# Altium schematic sheet MCP2515_PINOUT.SchDoc
size A; SheetNumber: 7; SheetTotal: 7
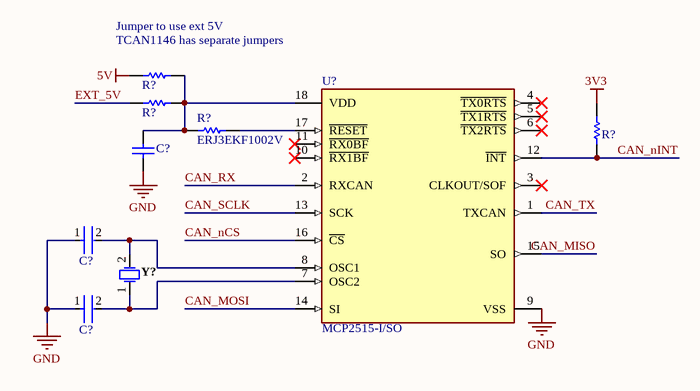
[diagram p0: MCP2515_PINOUT.SchDoc]

## Parts
(Parts that share a designator on the sheet are numbered #1, #2 ... from top to bottom, then left to right.)
C?#1  1206GC102KAT1A  [AVX-1206-2_L]  (value not drawn)
C?#2  GRM188R60J106ME47D  [FP-GRM188-0_1-e0_2_0_55-IPC_A]  (value not drawn)
C?#3  GRM188R60J106ME47D  [FP-GRM188-0_1-e0_2_0_55-IPC_A]  (value not drawn)
R?#1  0402 JUMPER 0 OHM  [RESC1005X40X25NL05T05]  (value not drawn)
R?#2  0402 JUMPER 0 OHM  [RESC1005X40X25NL05T05]  (value not drawn)
R?#3  ERJ3EKF1002V  [RESC1609X55X30LL15T15]  (value not drawn)
R?#4  ERJ3EKF1002V  [RESC1609X55X30LL15T15]
U?  MCP2515-I/SO  [FP-C04-051-MFG]
Y?  FOXSLF/160-20  [FOX-FOXSLF160-20]  (value not drawn)

## Nets
3V3: R?#3.1
5V: R?#1.1
GND: C?#1.1 C?#2.1 C?#3.1 U?.9(VSS)
CAN_MISO: U?.15(SO)
CAN_MOSI: U?.14(SI)
CAN_nCS: U?.16(~{CS})
CAN_nINT: R?#3.2 U?.12(~{INT})
CAN_RX: U?.2(RXCAN)
CAN_SCLK: U?.13(SCK)
CAN_TX: U?.1(TXCAN)
EXT_5V: R?#2.1
NetC?#1_2: C?#1.2 R?#1.2 R?#2.2 R?#4.1 U?.18(VDD)
NetC?#2_2: C?#2.2 U?.8(OSC1) Y?.2
NetC?#3_2: C?#3.2 U?.7(OSC2) Y?.1
NetR?#4_2: R?#4.2 U?.17(~{RESET})

Not connected (* = marked no-connect by the designer): U? 3(CLKOUT/SOF)* 4(~{TX0RTS})* 5(~{TX1RTS})* 6(~{TX2RTS})* 10(~{RX1BF})* 11(~{RX0BF})*

## Notes on the sheet
- (near R?#1) Jumper to use ext 5V
- (near R?#1) TCAN1146 has separate jumpers

## Library data of the parts
C?#1 = CMP-2000-05468-1: Chip Capacitor, 1 nF, +/- 10%, -55 to 125 degC, 1206 (3216 Metric), RoHS, Tape and Reel; Manufacturer: AVX; Capacitance: 0.001uF; Dielectric: X7R; Voltage Rating DC: 2000V; Package Reference: 1206; Datasheet Version: 11/2010; Mounting Technology: SurfaceMount; Manufacturer URL: http://www.avx.com/; Tolerance: 10%; Tolerance (%): ±10%; PartNumber: 1206GC102KAT1A; Datasheet URL: https://datasheet.ciiva.com/11787/0900766b80ed4c37-11787781.pdf; Package Description: 2-Pin SMD, Body 3.4 x 1.8 mm; Case Size/Dimension: 1206; Rated Voltage: 2000V
C?#2 C?#3 = CMP-2006-02792-2: Chip Multilayer Ceramic Capacitors for General Purpose, 0603, 10uF, X5R, 15%, 20%, 6.3V; Packaging: Tape and Reel; Voltage Rating (DC): 6.3V; Width: 0.031inch; Termination: SMD/SMT; Dielectric: X5R; Package Quantity: 4000; Voltage Rating: 6.3V; Capacitance: 10uF; Case/Package: 0603; Min Operating Temperature: -55°C; Voltage: 6.3V; Length: 1.6mm; Thickness: 0.035inch; Lead Free: Lead Free; Depth: 0.8mm; Case Code (Imperial): 0603; Max Operating Temperature: 85°C; Material: Ceramic; Height: 0.8mm; Tolerance: 20%; Mount: Surface Mount; REACH SVHC: No SVHC; Radiation Hardening: No; Case Code (Metric): 1608
R?#1 R?#2 = CMP-009-00206-2: READ THE NAME
R?#3 R?#4 = CMP-1012-00623-3: Chip Resistor, 10 KOhm, +/- 1%, 0.1 W, -55 to 155 degC, 0603 (1608 Metric), RoHS, Tape and Reel; Manufacturer: Panasonic; Voltage Rating: 75V; Case\/Package: 0603; Power Rating: 100mW; Resistance: 10KOhm; Temperature Coefficient: 100ppm\/degreesC; Number of Pins: 2; Package Reference: 603; Depth: 0.8mm; Mount: SurfaceMount; Package Description: 2-Pin Surface Mount Device, Body 1.6 x 0.85 mm; Datasheet Version: 02/2017; Length: 1.6mm; Lead Free: LeadFree; Height: 0.45mm; Number of Terminations: 2; Max Power Dissipation: 100mW; Min Operating Temperature: -55degC; Datasheet URL: https://industrial.panasonic.com/cdbs/www-data/pdf/RDA0000/AOA0000C304.pdf; Termination: SMD/SMT; Case Code (Metric): 1608; Case Code (Imperial): 0603; Tolerance: 1%; Max Operating Temperature: 155degC; RoHSCompliant: true; Voltage Rating (DC): 75V; Radiation Hardening: No; Packaging: TapeandReel; Composition: ThickFilm; Mounting Technology: SurfaceMount; Manufacturer URL: http://www.panasonic.com/; Width: 0.031inch; REACH SVHC: NoSVHC; Contact Plating: Tin; Military Standard: Not; Package Quantity: 1
U? = CMP-0186-00133-3: IC CAN CONTROLLER W/SPI 18SOIC; Manufacturer: Microchip; Min Supply Voltage: 2.7V; Max Supply Voltage: 5.5V; Standoff Height: 0.1mm; Nominal Supply Current: 10mA; Interface: SPI,CAN; Lead Free: Yes; Digikey Description: IC CAN CONTROLLER W/SPI 18SOIC; Category: IC; RoHS: TRUE; Manufacturer Part Number: MCP2515-I/SO; ComponentLink2URL: http://ww1.microchip.com/downloads/en/DeviceDoc/MCP2515-Stand-Alone-CAN-Controller-with-SPI-20001801J.pdf; Mouser Description: CAN Interface IC W/ SPI Interface; Device Class L2: Interface ICs; Package: C04-051; Automotive: No; Function: Controller; Octopart: https://octopart.com/mcp2515-i%2Fso-microchip-430187; Temperature: -40°C to +85°C; Ipc Land Pattern Name: SOIC127P1030X265-18; Ambient Temperature Range Low: -65°C; Height: 2.65mm; Device Class L1: Integrated Circuits (ICs); Ambient Temperature Range High: +125°C; Footprint Url: http://ww1.microchip.com/downloads/en/DeviceDoc/18L_SOIC_Wide_7.50_SO_C04-0051D.pdf; Temperature Range Low: -40°C; Device Class L3: Controllers; Temperature Range High: +85°C; ComponentLink2Description: Datasheet
Y? = CMP-1749-00003-1: Resistance Weld Thru-Hole Crystal, 16 MHz, -20 to 70 degC, 2-Pin THD, RoHS, Bulk; Voltage Rating: 250 V; Tolerance: 1%; Resistance: 221 kohm; Case\Package: Axial; Power Rating: 250 mW; RoHSCompliant: true; Package Quantity: 200; Packaging: Bulk; Min Operating Temperature: -55 degC; DatasheetVersion: Mar-15; ComponentLink1URL: http://www.foxonline.com/; Max Operating Temperature: 155 degC; PackageReference: FOXSLF160-20; Mount: Through Hole; PackageDescription: 2-Pin Through Hole Device, Body 11.35 x 4.65 mm; ComponentLink1Description: Manufacturer URL; ComponentLink2URL: http://www.foxonline.com/pdfs/hc49slf.pdf; ComponentLink2Description: Datasheet; Length: 0.248 inch